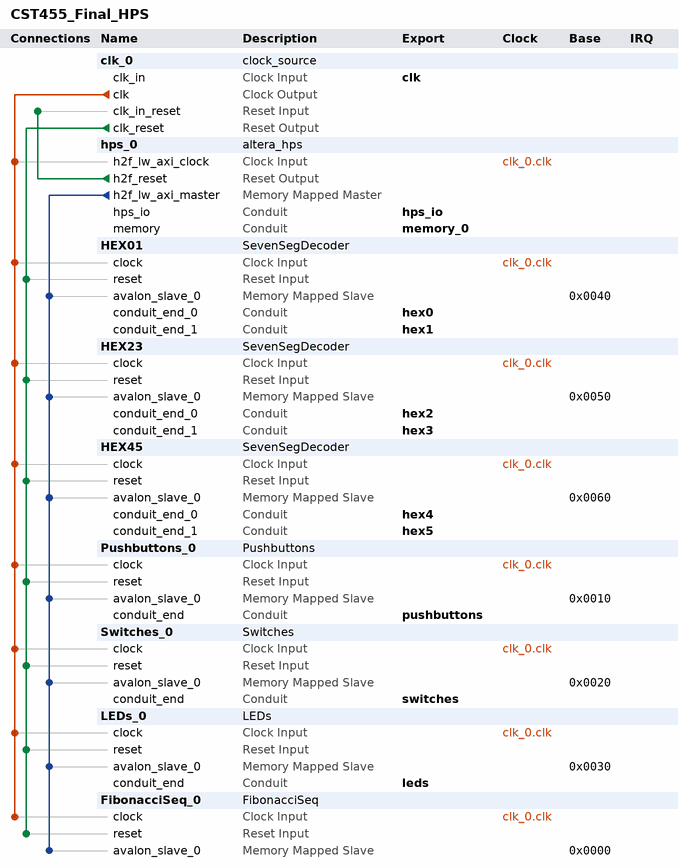
[diagram p0: system contents]
# Platform Designer (Qsys) system CST455_Final_HPS, Cyclone V 5CSXFC6D6F31C6
# Parameters at their usual value, and those the tool derives, are not listed.
package require -exact qsys 22.1
create_system CST455_Final_HPS
set_project_property DEVICE_FAMILY {Cyclone V}
set_project_property DEVICE 5CSXFC6D6F31C6

add_instance clk_0 clock_source 22.1
set_instance_parameter_value clk_0 clockFrequency 50000000

add_instance hps_0 altera_hps 22.1
set_instance_parameter_value hps_0 EMAC1_Mode RGMII
set_instance_parameter_value hps_0 EMAC1_PinMuxing {HPS I/O Set 0}
set_instance_parameter_value hps_0 F2SCLK_COLDRST_Enable false
set_instance_parameter_value hps_0 F2SCLK_DBGRST_Enable false
set_instance_parameter_value hps_0 F2SCLK_WARMRST_Enable false
set_instance_parameter_value hps_0 F2SINTERRUPT_Enable false
set_instance_parameter_value hps_0 F2S_Width 0
set_instance_parameter_value hps_0 FPGA_PERIPHERAL_OUTPUT_CLOCK_FREQ_EMAC0_GTX_CLK 125
set_instance_parameter_value hps_0 FPGA_PERIPHERAL_OUTPUT_CLOCK_FREQ_EMAC0_MD_CLK 2.5
set_instance_parameter_value hps_0 FPGA_PERIPHERAL_OUTPUT_CLOCK_FREQ_EMAC1_GTX_CLK 125
set_instance_parameter_value hps_0 FPGA_PERIPHERAL_OUTPUT_CLOCK_FREQ_EMAC1_MD_CLK 2.5
set_instance_parameter_value hps_0 HPS_PROTOCOL DDR3
set_instance_parameter_value hps_0 I2C0_Mode N/A
set_instance_parameter_value hps_0 I2C0_PinMuxing Unused
set_instance_parameter_value hps_0 I2C1_Mode N/A
set_instance_parameter_value hps_0 I2C1_PinMuxing Unused
set_instance_parameter_value hps_0 LWH2F_Enable true
set_instance_parameter_value hps_0 MEM_BANKADDR_WIDTH 3
set_instance_parameter_value hps_0 MEM_CLK_FREQ 400.0
set_instance_parameter_value hps_0 MEM_COL_ADDR_WIDTH 10
set_instance_parameter_value hps_0 MEM_DQ_WIDTH 32
set_instance_parameter_value hps_0 MEM_DRV_STR RZQ/6
set_instance_parameter_value hps_0 MEM_ROW_ADDR_WIDTH 15
set_instance_parameter_value hps_0 MEM_RTT_NOM RZQ/6
set_instance_parameter_value hps_0 MEM_RTT_WR {Dynamic ODT off}
set_instance_parameter_value hps_0 MEM_TCL 11
set_instance_parameter_value hps_0 MEM_TFAW_NS 45.0
set_instance_parameter_value hps_0 MEM_TRAS_NS 35.0
set_instance_parameter_value hps_0 MEM_TRCD_NS 13.75
set_instance_parameter_value hps_0 MEM_TRFC_NS 260.0
set_instance_parameter_value hps_0 MEM_TRP_NS 13.75
set_instance_parameter_value hps_0 MEM_VENDOR Micron
set_instance_parameter_value hps_0 MEM_WTCL 7
set_instance_parameter_value hps_0 QSPI_Mode N/A
set_instance_parameter_value hps_0 QSPI_PinMuxing Unused
set_instance_parameter_value hps_0 REF_CLK_FREQ 25.0
set_instance_parameter_value hps_0 S2FCLK_USER2CLK 5
set_instance_parameter_value hps_0 S2F_Width 0
set_instance_parameter_value hps_0 SDIO_Mode {4-bit Data}
set_instance_parameter_value hps_0 SDIO_PinMuxing {HPS I/O Set 0}
set_instance_parameter_value hps_0 SPIM1_Mode N/A
set_instance_parameter_value hps_0 SPIM1_PinMuxing Unused
set_instance_parameter_value hps_0 STM_Enable false
set_instance_parameter_value hps_0 TIMING_BOARD_AC_SKEW 0.02
set_instance_parameter_value hps_0 TIMING_BOARD_AC_TO_CK_SKEW 0.01
set_instance_parameter_value hps_0 TIMING_BOARD_DQ_TO_DQS_SKEW 0.05
set_instance_parameter_value hps_0 TIMING_BOARD_MAX_CK_DELAY 0.03
set_instance_parameter_value hps_0 TIMING_BOARD_MAX_DQS_DELAY 0.02
set_instance_parameter_value hps_0 TIMING_BOARD_SKEW_BETWEEN_DQS 0.06
set_instance_parameter_value hps_0 TIMING_BOARD_SKEW_CKDQS_DIMM_MAX 0.12
set_instance_parameter_value hps_0 TIMING_BOARD_SKEW_CKDQS_DIMM_MIN 0.06
set_instance_parameter_value hps_0 TIMING_BOARD_SKEW_WITHIN_DQS 0.01
set_instance_parameter_value hps_0 TIMING_TDH 65
set_instance_parameter_value hps_0 TIMING_TDQSCK 255
set_instance_parameter_value hps_0 TIMING_TDQSQ 125
set_instance_parameter_value hps_0 TIMING_TDS 30
set_instance_parameter_value hps_0 TIMING_TIH 140
set_instance_parameter_value hps_0 TIMING_TIS 190
set_instance_parameter_value hps_0 TIMING_TQSH 0.4
set_instance_parameter_value hps_0 UART0_Mode {No Flow Control}
set_instance_parameter_value hps_0 UART0_PinMuxing {HPS I/O Set 0}
set_instance_parameter_value hps_0 USB1_Mode SDR
set_instance_parameter_value hps_0 USB1_PinMuxing {HPS I/O Set 0}
set_instance_parameter_value hps_0 desired_cfg_clk_mhz 100.0
set_instance_parameter_value hps_0 desired_qspi_clk_mhz 400.0

add_instance HEX01 SevenSegDecoder 1.0

add_instance HEX23 SevenSegDecoder 1.0

add_instance HEX45 SevenSegDecoder 1.0

add_instance Pushbuttons_0 Pushbuttons 1.0

add_instance Switches_0 Switches 1.0

add_instance LEDs_0 LEDs 1.0

add_instance FibonacciSeq_0 FibonacciSeq 1.0

# connections
add_connection clk_0.clk FibonacciSeq_0.clock clock
add_connection clk_0.clk HEX01.clock clock
add_connection clk_0.clk HEX23.clock clock
add_connection clk_0.clk HEX45.clock clock
add_connection clk_0.clk hps_0.h2f_lw_axi_clock clock
add_connection clk_0.clk LEDs_0.clock clock
add_connection clk_0.clk Pushbuttons_0.clock clock
add_connection clk_0.clk Switches_0.clock clock
add_connection clk_0.clk_reset FibonacciSeq_0.reset reset
add_connection clk_0.clk_reset HEX01.reset reset
add_connection clk_0.clk_reset HEX23.reset reset
add_connection clk_0.clk_reset HEX45.reset reset
add_connection clk_0.clk_reset LEDs_0.reset reset
add_connection clk_0.clk_reset Pushbuttons_0.reset reset
add_connection clk_0.clk_reset Switches_0.reset reset
add_connection hps_0.h2f_reset clk_0.clk_in_reset reset
add_connection hps_0.h2f_lw_axi_master FibonacciSeq_0.avalon_slave_0 avalon
set_connection_parameter_value hps_0.h2f_lw_axi_master/FibonacciSeq_0.avalon_slave_0 baseAddress 0x0000
add_connection hps_0.h2f_lw_axi_master HEX01.avalon_slave_0 avalon
set_connection_parameter_value hps_0.h2f_lw_axi_master/HEX01.avalon_slave_0 baseAddress 0x0040
add_connection hps_0.h2f_lw_axi_master HEX23.avalon_slave_0 avalon
set_connection_parameter_value hps_0.h2f_lw_axi_master/HEX23.avalon_slave_0 baseAddress 0x0050
add_connection hps_0.h2f_lw_axi_master HEX45.avalon_slave_0 avalon
set_connection_parameter_value hps_0.h2f_lw_axi_master/HEX45.avalon_slave_0 baseAddress 0x0060
add_connection hps_0.h2f_lw_axi_master LEDs_0.avalon_slave_0 avalon
set_connection_parameter_value hps_0.h2f_lw_axi_master/LEDs_0.avalon_slave_0 baseAddress 0x0030
add_connection hps_0.h2f_lw_axi_master Pushbuttons_0.avalon_slave_0 avalon
set_connection_parameter_value hps_0.h2f_lw_axi_master/Pushbuttons_0.avalon_slave_0 baseAddress 0x0010
add_connection hps_0.h2f_lw_axi_master Switches_0.avalon_slave_0 avalon
set_connection_parameter_value hps_0.h2f_lw_axi_master/Switches_0.avalon_slave_0 baseAddress 0x0020

# exported interfaces
add_interface clk clock sink
set_interface_property clk EXPORT_OF clk_0.clk_in
add_interface hex0 conduit end
set_interface_property hex0 EXPORT_OF HEX01.conduit_end_0
add_interface hex1 conduit end
set_interface_property hex1 EXPORT_OF HEX01.conduit_end_1
add_interface hex2 conduit end
set_interface_property hex2 EXPORT_OF HEX23.conduit_end_0
add_interface hex3 conduit end
set_interface_property hex3 EXPORT_OF HEX23.conduit_end_1
add_interface hex4 conduit end
set_interface_property hex4 EXPORT_OF HEX45.conduit_end_0
add_interface hex5 conduit end
set_interface_property hex5 EXPORT_OF HEX45.conduit_end_1
add_interface hps_io conduit end
set_interface_property hps_io EXPORT_OF hps_0.hps_io
add_interface leds conduit end
set_interface_property leds EXPORT_OF LEDs_0.conduit_end
add_interface memory_0 conduit end
set_interface_property memory_0 EXPORT_OF hps_0.memory
add_interface pushbuttons conduit end
set_interface_property pushbuttons EXPORT_OF Pushbuttons_0.conduit_end
add_interface switches conduit end
set_interface_property switches EXPORT_OF Switches_0.conduit_end

set_interconnect_requirement {$system} qsys_mm.clockCrossingAdapter HANDSHAKE
set_interconnect_requirement {$system} qsys_mm.enableEccProtection FALSE
set_interconnect_requirement {$system} qsys_mm.insertDefaultSlave FALSE
set_interconnect_requirement {$system} qsys_mm.maxAdditionalLatency 1

save_system CST455_Final_HPS.qsys
